# Altium schematic sheet ADC.SchDoc
size A4; SheetNumber: 2; SheetTotal: 4
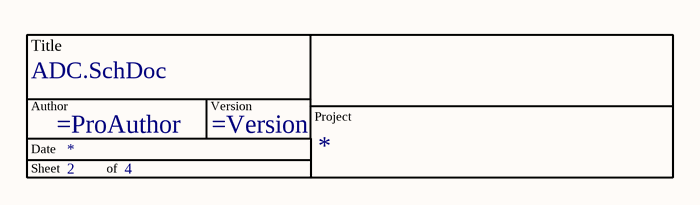
[diagram p0: ADC.SchDoc]

## Parts
?  Title_Block  (value not drawn)

## Notes on the sheet
- (in symbol Title_Block) Title; Author; Version; Project; Date; Sheet; of